# EasyEDA Pro project ProPrj_2401336012洪灿锋+2401336029沈亦豪+宿舍火灾报警系统+行业工程实践_2025-09-21.epro

# Schematic _Schematic1
Board Name: _Schematic1; Create Date: 2025-09-14; Page Name: 1_P1; Project Name: 2401336012洪灿锋+2401336029沈亦豪宿舍火灾报警系统原理图与PCB工程文件; Schematic Name: _Schematic1; Update Date: 2025-09-14
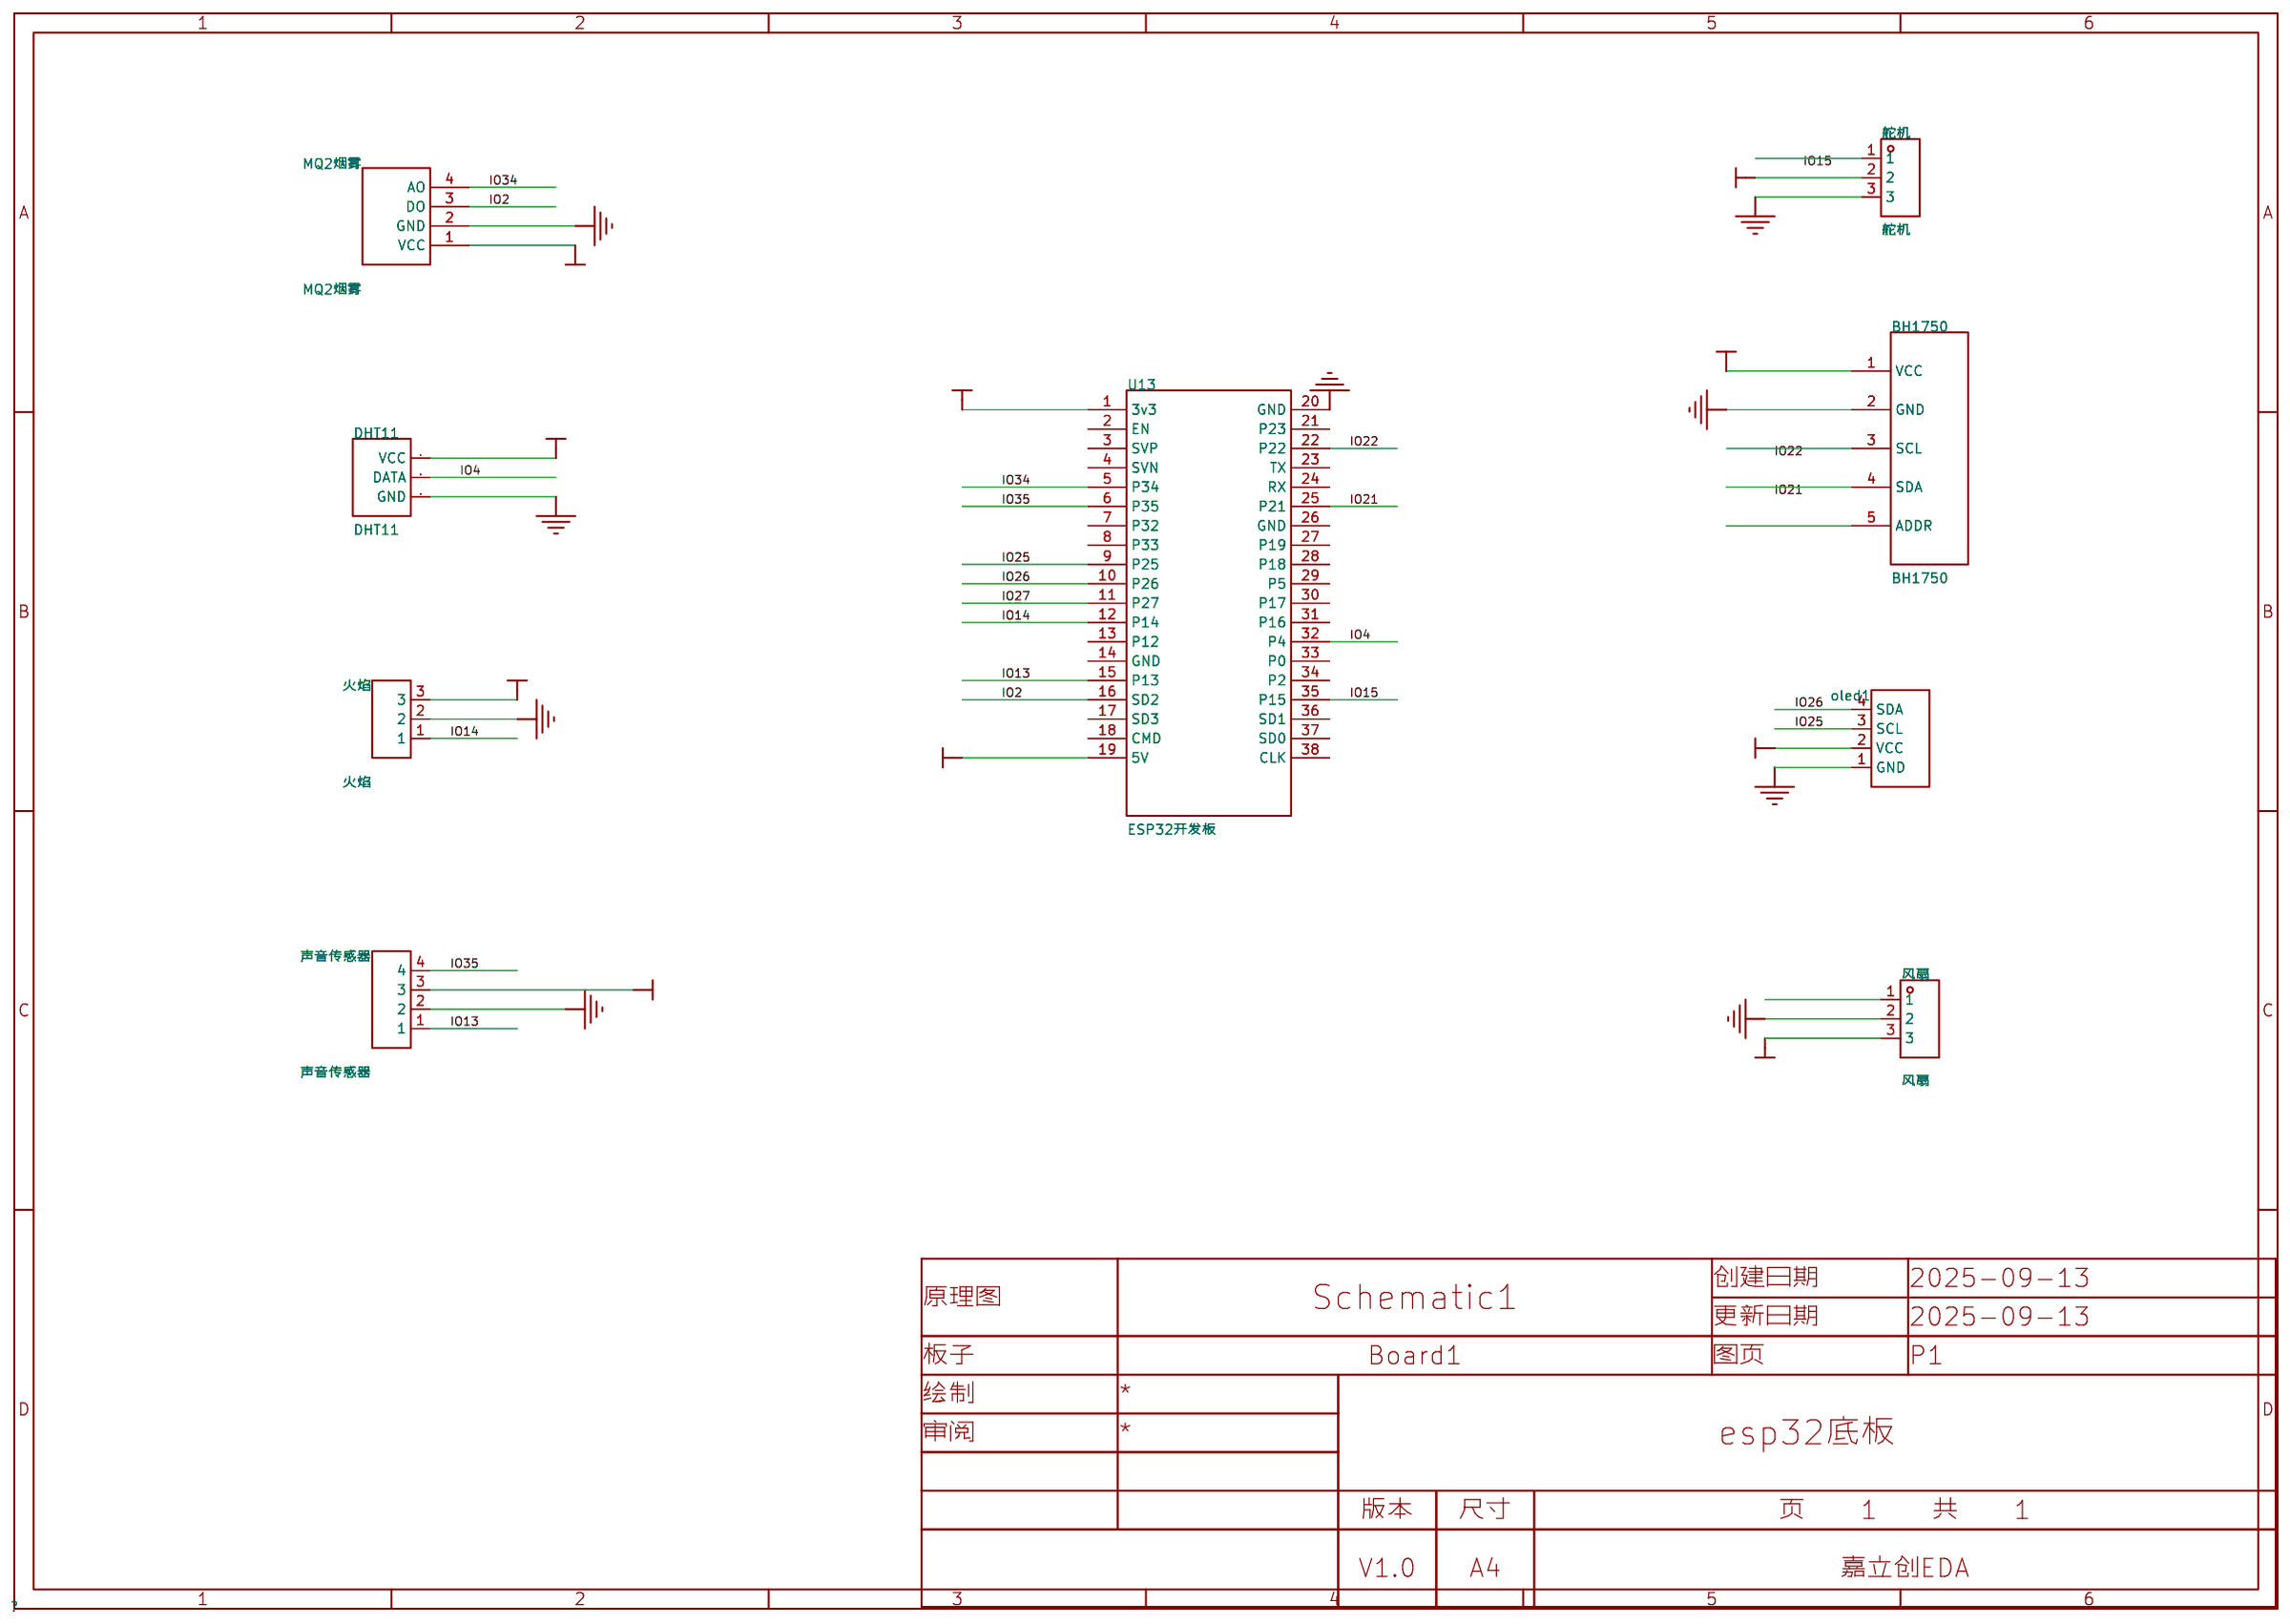
[diagram p0: schematic sheet]

## Parts
BH1750  BH1750  [BH1750_(GY-302)]
DHT11  DHT11  [DHT11_X]
MQ2烟雾  MQ2烟雾  [mq2]
oled1  OLED0.96  [OLED-0.96]
U13  ESP32开发板  [ESP32___]
声音传感器  声音传感器  [HDR-TH_A254UP-ZD04P]
火焰  火焰  [HDR-TH_3P-P2.54-V-M]
舵机  PZ254V-11-03P  [HDR-TH_3P-P2.54-V-M]
风扇  PZ254V-11-03P  [HDR-TH_3P-P2.54-V-M]

## Library data of the parts
BH1750 = BH1750
DHT11 = DHT11
MQ2烟雾 = MQ2
oled1 = OLED0.96: Supplier: Add New Supplier
U13 = ESP32开发板
声音传感器 = A254UP-ZD04P: 插针结构:1x4P;间距:2.54mm;行距:-;圆针/方针:方针;排数:单排;总PIN位数:4P;额定电流:3A;配合针长度:6mm;塑高:2.5mm;工作温度:-40℃~+105℃;; LCSC Part Name: 1x4P 间距:2.54mm 方针; Supplier Part: C41413833; Manufacturer: BXCONN(宝讯); Supplier Footprint: 插件,P=2.54mm; JLCPCB Part Class: 扩展库; Datasheet: https://item.szlcsc.com/datasheet/A254UP-ZD04P/43230040.html; Supplier: LCSC; Pin Structure: 1x4P; Pitch: 2.54mm; Circluar Pins/Square Pins: 方针; Number of Rows: 单排; Number of Pins: 4P; Current Rating: 3A; Length of Mating Pin: 6mm; Insulation Height: 2.5mm; Operating Temperature: -40℃~+105℃
火焰 = PH2.54-01-03PZD: 插针结构:1x3P;间距:2.54mm;圆针/方针:方针;安装方式:直插;排数:单排;总PIN位数:3P;配合针长度:6mm;塑高:2.5mm;端接针长度:3mm;触头材质:黄铜;工作温度:-40℃~+105℃;颜色:黑色;; LCSC Part Name: 1x3P 间距:2.54mm 方针 直插; Supplier Part: C7501581; Manufacturer: XUNPU(讯普); Supplier Footprint: 插件,P=2.54mm; JLCPCB Part Class: 扩展库; Datasheet: https://atta.szlcsc.com/upload/public/pdf/source/20230815/30A24B1E4B9BDE2239C7F8E56770F33B.pdf; Supplier: LCSC; Pin Structure: 1x3P; Pitch: 2.54mm; Circluar Pins/Square Pins: 方针; Mounting Type: 直插; Number of Rows: 单排; Number of Pins: 3P; Length of Mating Pin: 6mm; Insulation Height: 2.5mm; Length of End Connection Pin: 3mm; Contact Material: 黄铜; Operating Temperature: -40℃~+105℃; Color: 黑色
舵机 风扇 = PZ254V-11-03P_C2937625: 排数：单排;总PIN位数:3;间距:2.54mm;插针结构:1x3P;行距:-;安装类型:直插;圆针/方针:方针;额定电流:3A;额定电压:250V;配合针长度:6mm;塑高:2.5mm;端接针长度:3mm;工作温度范围:-40℃~+105℃;颜色:黑色;; LCSC Part Name: 2.54mm 1x3P 直插 方针; Supplier Part: C2937625; Manufacturer: XFCN(兴飞); Supplier Footprint: 直插,P=2.54mm; JLCPCB Part Class: Extended Part; Datasheet: 2022-07-12/581362A/62b9d00620994b3696be7eb4af85ad72/双排排针和单排排针.pdf; Supplier: LCSC; Number of Rows: 单排; Number of Pins: 3; Pitch: 2.54mm; Pin Structure: 1x3P; Mounting Type: 直插; Circluar Pins/Square Pins: 方针; Current Rating (Max): 3A; Voltage Rating (Max): 250V; Length of Mating Pin: 6mm; Insulation Height: 2.5mm; Length of End Connection Pin: 3mm; Operating Temperature Range: -40℃~+105℃; Color: 黑色; 购买链接: https://item.szlcsc.com/3293280.html

## Nets
+5V: MQ2烟雾.1(VCC) U13.19(5V) 声音传感器.3 舵机.2 风扇.3
GND: BH1750.2(GND) DHT11.3(GND) MQ2烟雾.2(GND) oled1.1(GND) U13.20(GND) 声音传感器.2 火焰.2 舵机.3 风扇.2
VCC: BH1750.1(VCC) DHT11.1(VCC) oled1.2(VCC) U13.1(3v3) 火焰.3
$$$1: BH1750.5(ADDR)
$$$2: 风扇.1
IO2: MQ2烟雾.3(DO) U13.16(SD2)
IO4: DHT11.2(DATA) U13.32(P4)
IO13: U13.15(P13) 声音传感器.1
IO14: U13.12(P14) 火焰.1
IO15: U13.35(P15) 舵机.1
IO21: BH1750.4(SDA) U13.25(P21)
IO22: BH1750.3(SCL) U13.22(P22)
IO25: oled1.3(SCL) U13.9(P25)
IO26: oled1.4(SDA) U13.10(P26)
IO27: U13.11(P27)
IO34: MQ2烟雾.4(AO) U13.5(P34)
IO35: U13.6(P35) 声音传感器.4

Not connected (* = marked no-connect by the designer): U13 2(EN) 3(SVP) 4(SVN) 7(P32) 8(P33) 13(P12) 14(GND) 17(SD3) 18(CMD) 21(P23) 23(TX) 24(RX) 26(GND) 27(P19) 28(P18) 29(P5) 30(P17) 31(P16) 33(P0) 34(P2) 36(SD1) 37(SD0) 38(CLK)

# Board PCB1
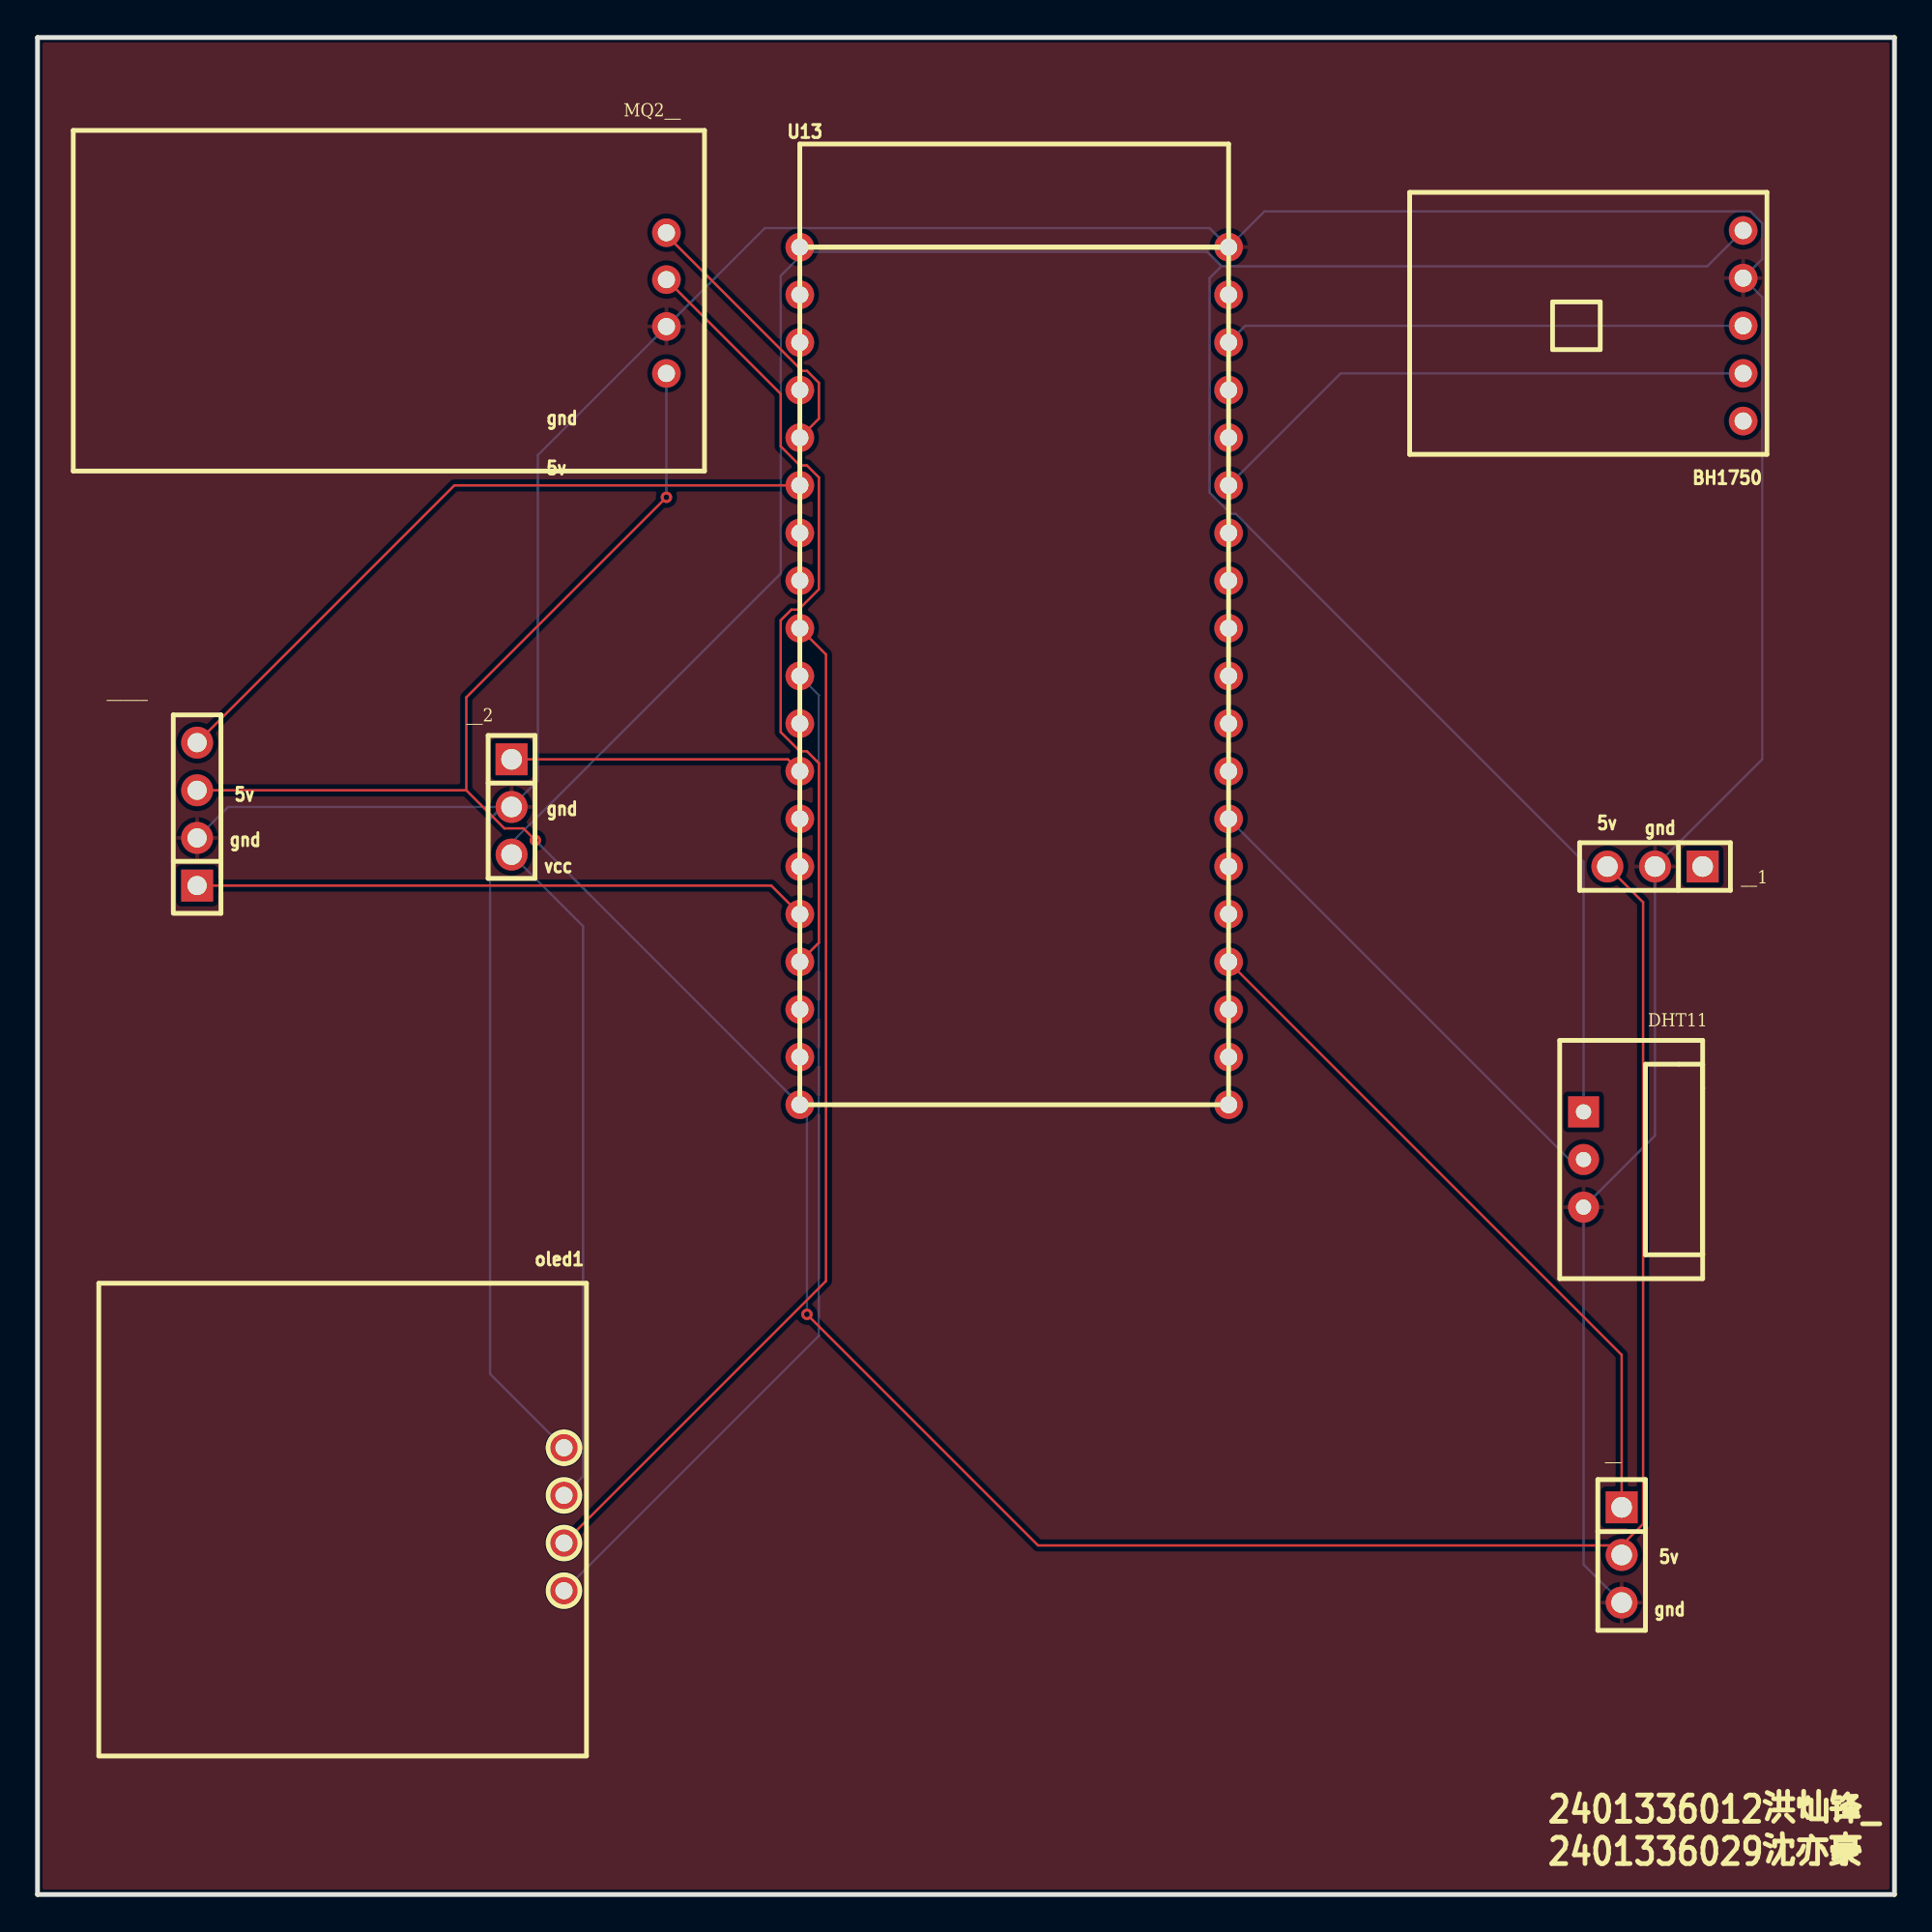
[diagram p1: board, top side]
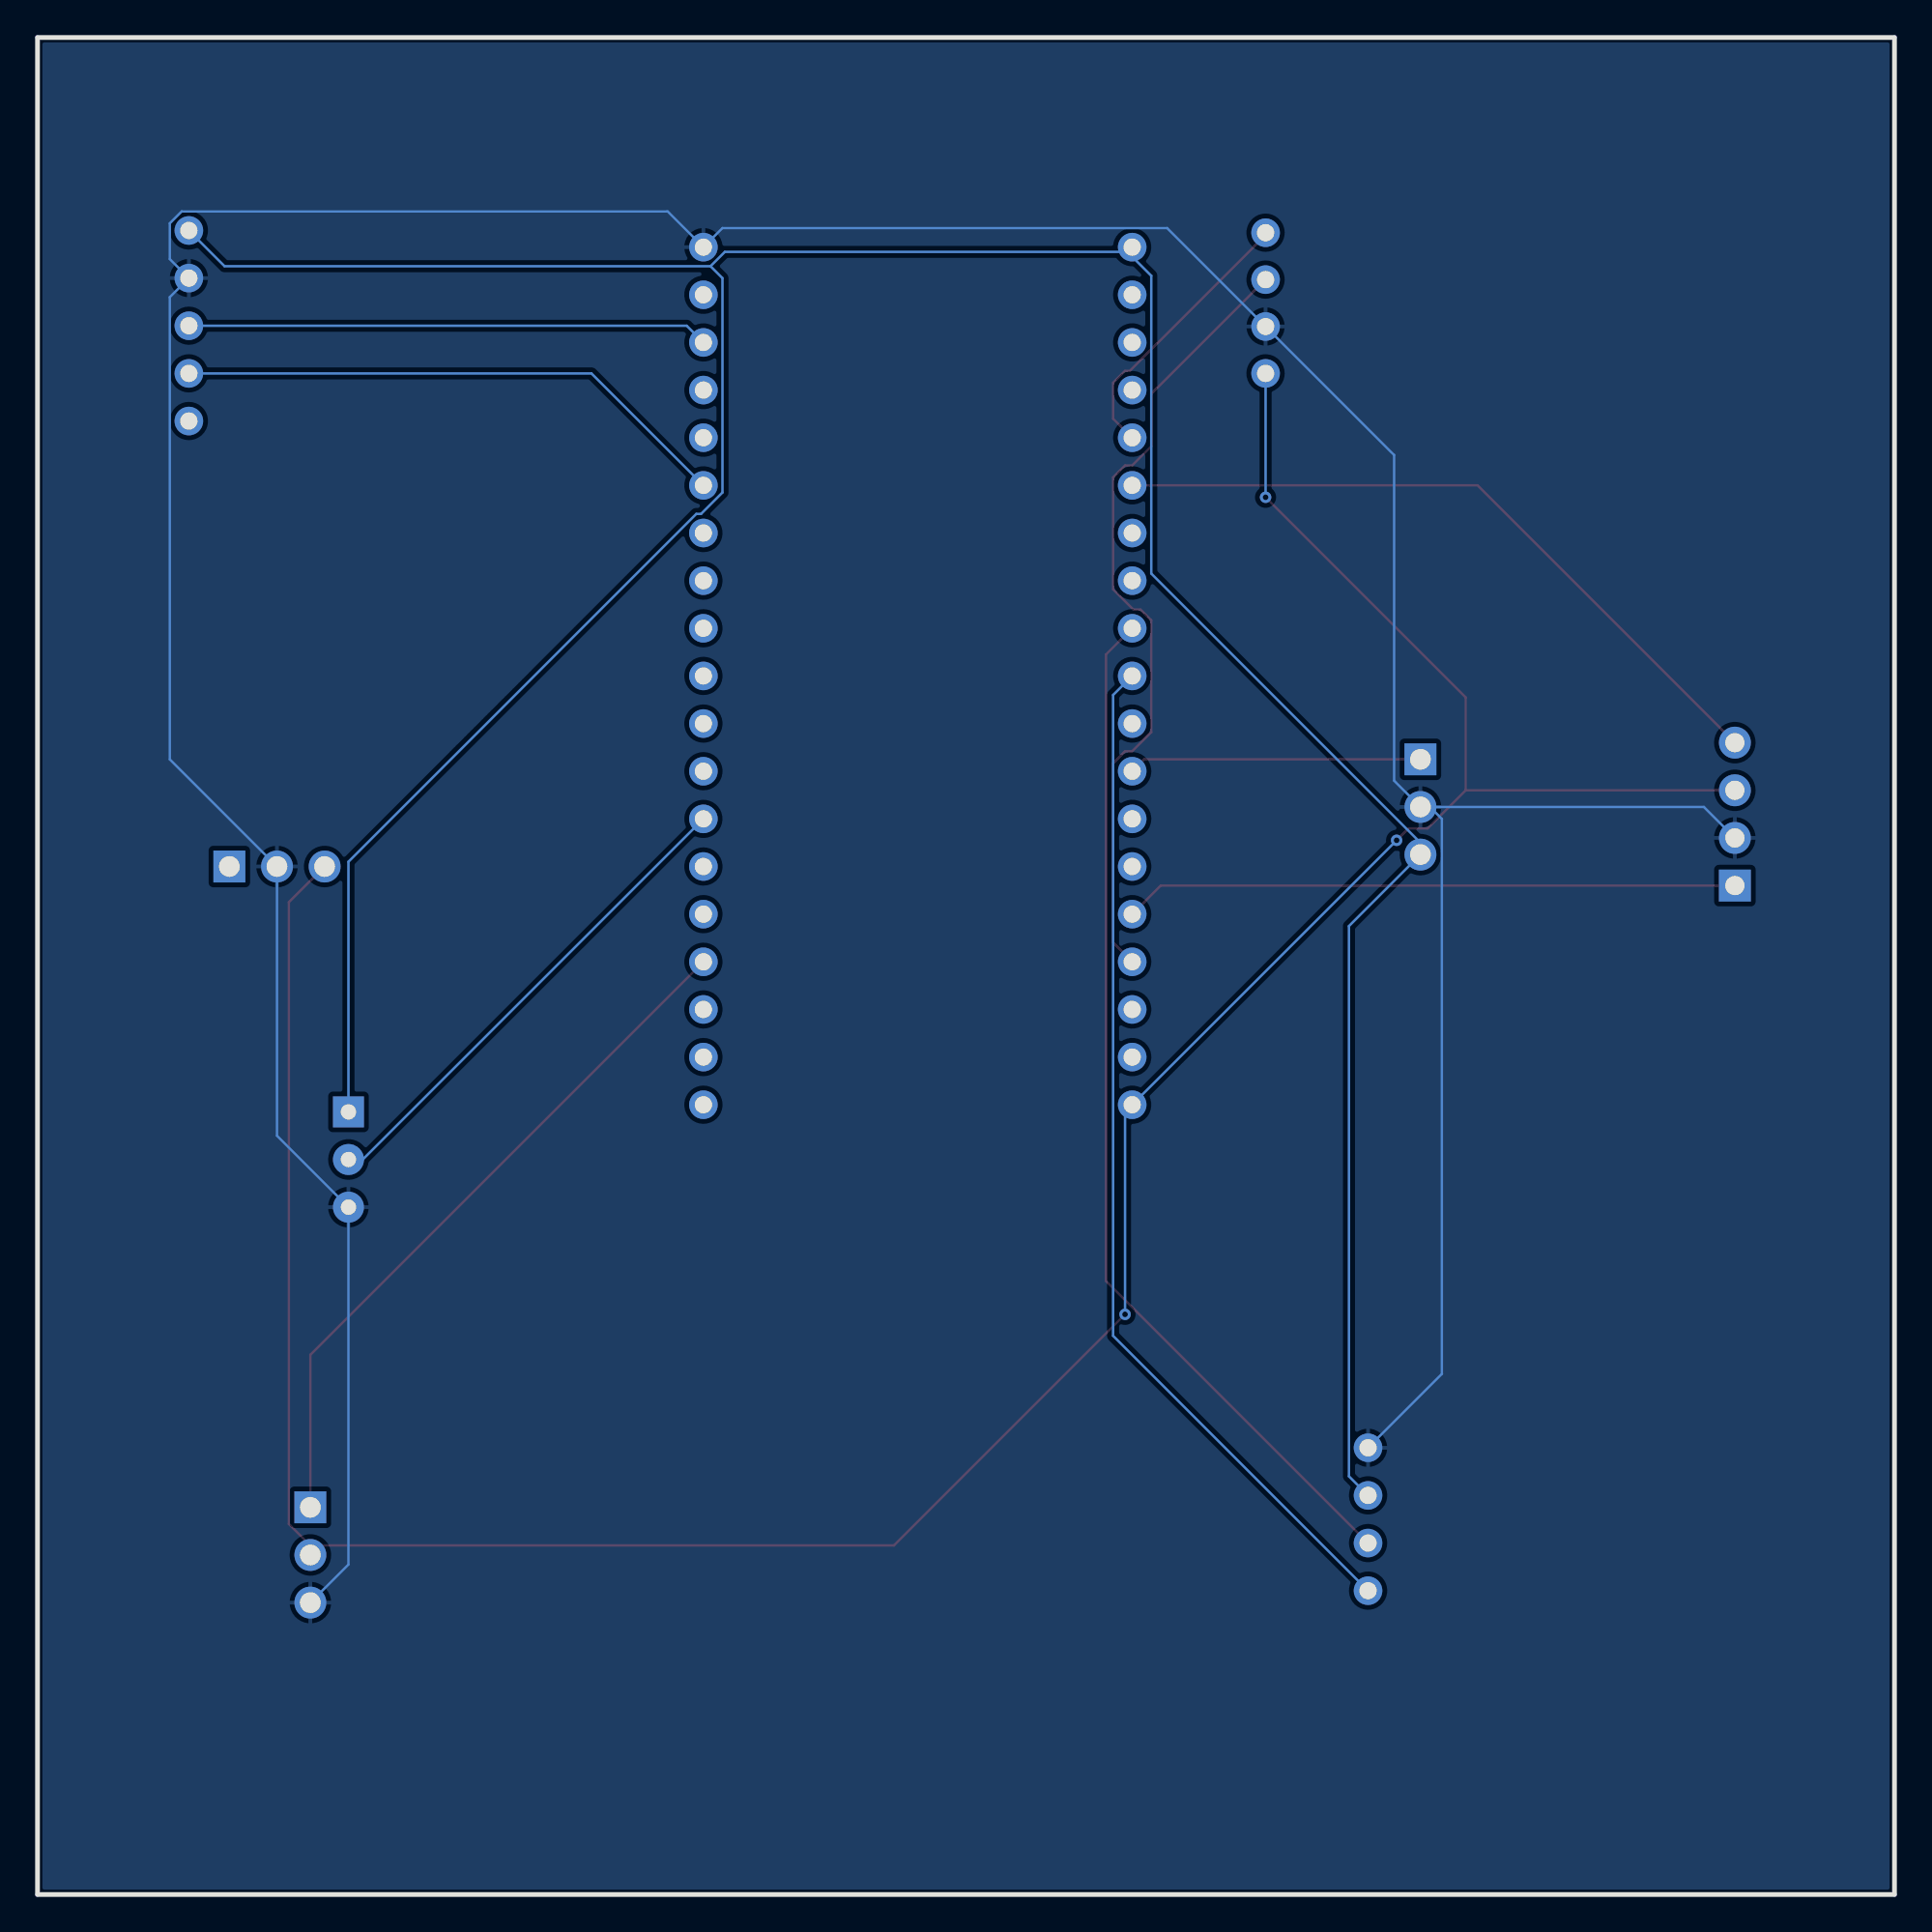
[diagram p2: board, bottom side, seen from below]

Outline 99 x 99 mm; copper layers: Top Layer, Bottom Layer. Coordinates in mm from the lower left corner of the outline.
Outline path: 0,99 99,99 99,0 0,0 0,99
Stack: Top Layer 0.035mm / SUBSTRATE1 1.51mm er 5 / Bottom Layer 0.035mm

## Design rules (mm)
spacing safeClearance (default): track to track 0.102, other pairs 0 to 0.3
track width trackWidth (default): min 0.127, default 0.127, max 2.54
differential pair differentialPair (default): width min 0.127, default 0.254, max 2.54; gap min 0.152, default 0.152
via viaSize (default): diameter min 0.5, default 0.61, max 10; hole min 0.3, default 0.305, max 6

## Placement (name value [footprint] x y rotation side)
__  -  [HDR-TH_3P-P2.54-V-M]  84.46 18.1 270 top
__1  -  [HDR-TH_3P-P2.54-V-M]  86.23 54.8 180 top
__2  火焰  [HDR-TH_3P-P2.54-V-M1]  25.27 57.98 270 top
_____  声音传感器  [HDR-TH_A254UP-ZD04P]  8.51 57.6 90 top
BH1750  BH1750  [BH1750_(GY-302)]  90.93 78.55 180 top
DHT11  DHT11  [DHT11_X]  82.42 39.18 270 top
MQ2__  MQ2烟雾  [mq2]  -23.24 101.79 180 top
oled1  OLED0.96  [OLED-0.96]  28.07 20.01 270 top
U13  ESP32开发板  [ESP32___]  40.64 87.82 0 top

## Footprints (pads in the part's own frame, mm; a bottom-side part is the same pattern mirrored in y, then rotated)
BH1750_(GY-302)
  round 1.524 hole 0.914: 1(0,-10.16) 2(0,-7.62) 3(0,-5.08) 4(0,-2.54) 5(0,0)
DHT11_X
  rect 1.651x1.651 hole 0.81: 1(-2.54,0)
  round 1.651 hole 0.81: 2(0,0) 3(2.54,0)
ESP32___
  round 1.524 hole 0.914: 1(0,0) 2(0,-2.54) 3(0,-5.08) 4(0,-7.62) 5(0,-10.16) 6(0,-12.7) 7(0,-15.24) 8(0,-17.78) 9(0,-20.32) 10(0,-22.86) 11(0,-25.4) 12(0,-27.94) 13(0,-30.48) 14(0,-33.02) 15(0,-35.56) 16(0,-38.1) 17(0,-40.64) 18(0,-43.18) 19(0,-45.72) 20(22.86,0) 21(22.86,-2.54) 22(22.86,-5.08) 23(22.86,-7.62) 24(22.86,-10.16) 25(22.86,-12.7) 26(22.86,-15.24) 27(22.86,-17.78) 28(22.86,-20.32) 29(22.86,-22.86) 30(22.86,-25.4) 31(22.86,-27.94) 32(22.86,-30.48) 33(22.86,-33.02) 34(22.86,-35.56) 35(22.86,-38.1) 36(22.86,-40.64) 37(22.86,-43.18) 38(22.86,-45.72)
HDR-TH_3P-P2.54-V-M
  rect 1.7x1.7 hole 1.1: 1(-2.54,0)
  round 1.7 hole 1.1: 2(0,0) 3(2.54,0)
HDR-TH_3P-P2.54-V-M1
  rect 1.7x1.7 hole 1.1: 1(-2.54,0)
  round 1.7 hole 1.1: 2(0,0) 3(2.54,0)
HDR-TH_A254UP-ZD04P
  rect 1.7x1.7 hole 1.02: 1(-3.81,0)
  round 1.7 hole 1.02: 2(-1.27,0) 3(1.27,0) 4(3.81,0)
mq2
  round 1.524 hole 0.914: 1(-56.769,20.701) 2(-56.769,18.201) 3(-56.769,15.701) 4(-56.769,13.201)
OLED-0.96
  round 1.524 hole 0.914: 1(-3.81,0) 2(-1.27,0) 3(1.27,0) 4(3.81,0)

## Nets
+5V: __.2 __1.3 _____.3 MQ2__.1 U13.19
GND: __.3 __1.2 __2.2 _____.2 BH1750.2 DHT11.3 MQ2__.2 oled1.1 U13.20
VCC: __2.3 BH1750.1 DHT11.1 oled1.2 U13.1
IO2: MQ2__.3 U13.16
IO4: DHT11.2 U13.32
IO13: _____.1 U13.15
IO14: __2.1 U13.12
IO15: __.1 U13.35
IO21: BH1750.4 U13.25
IO22: BH1750.3 U13.22
IO25: oled1.3 U13.9
IO26: oled1.4 U13.10
IO34: MQ2__.4 U13.5
IO35: _____.4 U13.6

Pads without a net: __1 1; BH1750 5; U13 2 3 4 7 8 11 13 14 17 18 21 23 24 26 27 28 29 30 31 33 34 36 37 38

## Via types
v1: diameter 0.61, hole 0.305, Top Layer to Bottom Layer, 3 vias

## Routing (per net, layer and track width the routed paths; a pad name or vN(x,y) marks a point on that pad's centre or on a via; arc(x,y) is an arc through that point)
+5V: length 163.6
  Top Layer w0.127: v1(26.54,56.2) 25.91,56.84 24.89,56.84 22.86,58.87 ; 84.46,18.61 85.6,19.75 85.6,52.9 __1.3 ; 84.46,18.61 __.2 ; 84.46,18.61 53.34,18.61 v1(41.02,30.93) ; 22.86,58.87 22.86,63.82 v1(33.53,74.49) ; 22.86,58.87 _____.3
  Bottom Layer w0.127: v1(33.53,74.49) MQ2__.1 ; v1(41.02,30.93) 41.02,41.72 U13.19 v1(26.54,56.2)
GND: length 223.8
  Bottom Layer w0.127: __.3 82.42,17.59 DHT11.3 86.23,40.45 __1.2 91.95,60.52 91.95,85.16 BH1750.2 91.95,87.19 91.95,89.09 91.31,89.73 65.41,89.73 U13.20 62.48,88.84 38.78,88.84 MQ2__.2 26.67,76.74 26.67,59.38 __2.2 24.77,57.98 ; 24.77,57.98 10.16,57.98 _____.2 ; 24.77,57.98 24.13,57.34 24.13,27.75 oled1.1
VCC: length 180.1
  Bottom Layer w0.127: 63.12,86.81 62.36,87.57 40.64,87.57 ; 63.12,86.81 62.48,86.17 62.48,74.74 63.63,73.6 63.88,73.6 82.42,55.06 DHT11.1 ; 63.12,86.81 89.03,86.81 BH1750.1 ; 40.64,87.57 U13.1 ; 40.64,87.57 40.64,87.32 39.62,86.3 39.62,70.42 25.27,56.07 __2.3 29.08,51.63 29.08,22.29 oled1.2
IO2: length 42.5
  Top Layer w0.127: MQ2__.3 39.62,80 39.62,77.2 40.64,76.19 41.02,76.19 41.66,75.55 41.66,69.58 40.57,68.5 40.19,68.5 39.62,67.93 39.62,61.96 40.64,60.95 41.02,60.95 41.66,60.31 41.66,50.74 U13.16
IO4: length 26.4
  Bottom Layer w0.127: U13.32 81.66,39.18 DHT11.2
IO13: length 32.8
  Top Layer w0.127: _____.1 39.12,53.79 U13.15
IO14: length 15.6
  Top Layer w0.127: U13.12 40,60.52 __2.1
IO15: length 37.8
  Top Layer w0.127: U13.35 84.46,28.77 __.1
IO21: length 29.9
  Bottom Layer w0.127: U13.25 69.47,81.09 BH1750.4
IO22: length 27.8
  Bottom Layer w0.127: BH1750.3 64.39,83.63 U13.22
IO25: length 55.1
  Top Layer w0.127: U13.9 42.04,66.11 42.04,32.71 oled1.3
IO26: length 54.8
  Bottom Layer w0.127: oled1.4 41.66,29.78 41.66,63.95 U13.10
IO34: length 14.9
  Top Layer w0.127: MQ2__.4 33.53,88.47 40.77,81.23 41.02,81.23 41.66,80.59 41.66,78.68 U13.5
IO35: length 37.8
  Top Layer w0.127: U13.6 22.22,75.12 _____.4

## Copper pours and planes (outline as drawn; the poured copper is in the pictures)
GND on Top Layer: -2.16,100.91 103,100.91 103,-3.24 -2.16,-3.24
GND on Bottom Layer: -2.41,100.02 100.84,100.02 100.84,-2.47 -2.41,-2.47

## Text on the board
Top Silkscreen Layer: gnd | 5v | vcc | 2401336012洪灿锋_ / 2401336029沈亦豪
